# EAGLE design guava1_1 (EAGLE 8.0.0)
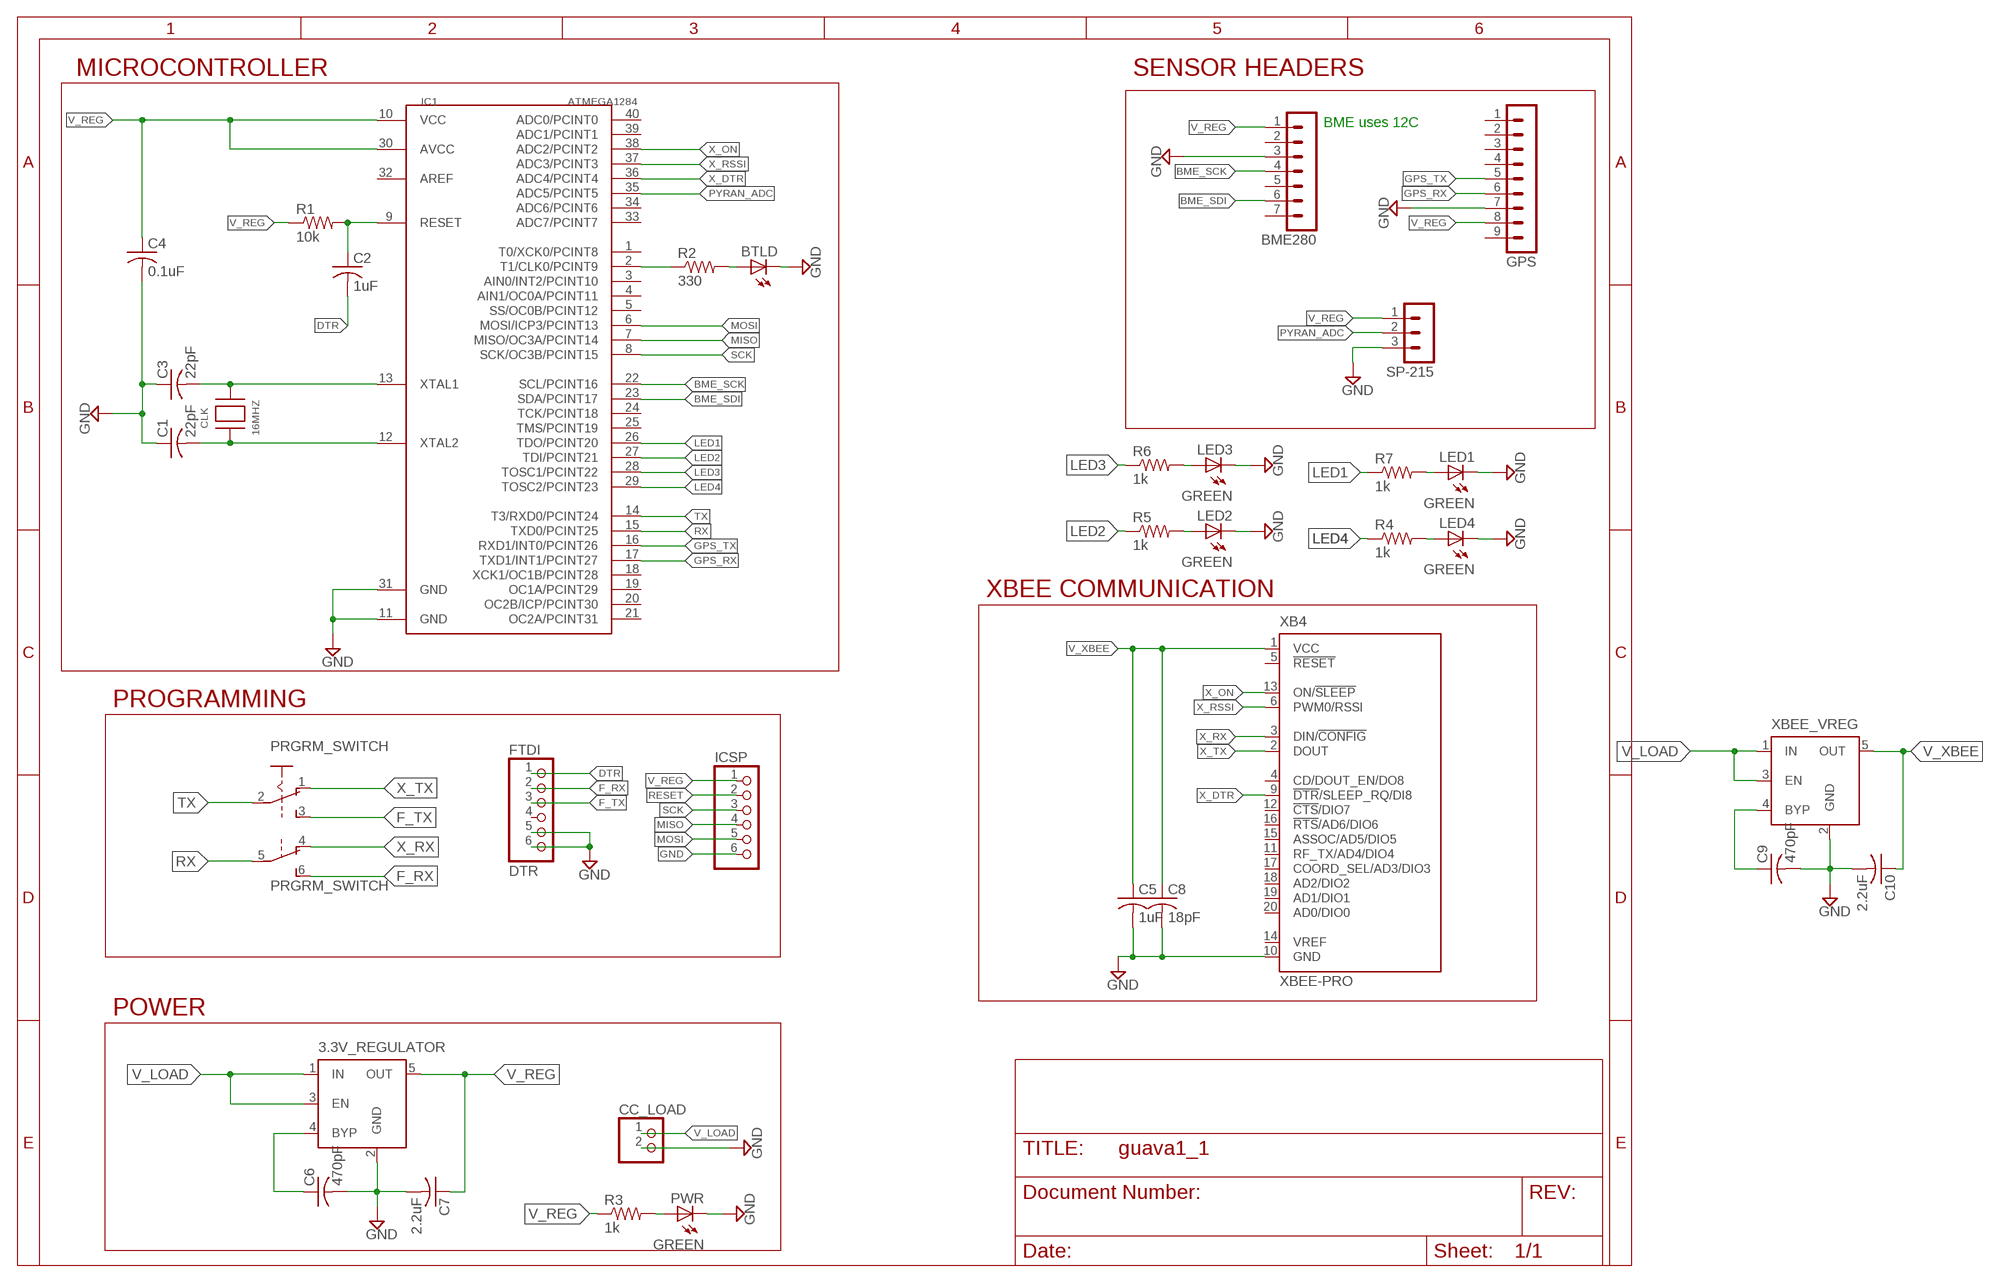
[diagram p0: schematic, sheet 1]

## Parts
3.3V_REGULATOR  MIC5219XX  [SOT23-5]
BME280  MA07-1  [MA07-1]
BTLD  LEDCHIPLED_0805  [CHIPLED_0805]
C1  22pF  C-USC0805  [C0805]
C2  1uF  C-USC0805  [C0805]
C3  22pF  C-USC0805  [C0805]
C4  0.1uF  C-USC0805  [C0805]
C5  1uF  C-USC0805  [C0805]
C6  470pF  C-USC0805  [C0805]
C7  2.2uF  C-USC0805  [C0805]
C8  18pF  C-USC0805  [C0805]
C9  470pF  C-USC0805  [C0805]
C10  2.2uF  C-USC0805  [C0805]
CC_LOAD  PINHD-1X2  [1X02]
CLK  16MHZ  XTALNX8045  [NX8045]
FTDI  DTR  PINHD-1X6  [1X06]
GPS  MA09-1  [MA09-1]
IC1  ATMEGA1284  MEGA1284P  [DIL40]
ICSP  PINHD-1X6  [1X06]
LED1  GREEN  LEDCHIPLED_0805  [CHIPLED_0805]
LED2  GREEN  LEDCHIPLED_0805  [CHIPLED_0805]
LED3  GREEN  LEDCHIPLED_0805  [CHIPLED_0805]
LED4  GREEN  LEDCHIPLED_0805  [CHIPLED_0805]
PRGRM_SWITCH  A68-A31  [A68-A31]
PWR  GREEN  LEDCHIPLED_0805  [CHIPLED_0805]
R1  10k  R-US_R0805  [R0805]
R2  330  R-US_R0805  [R0805]
R3  1k  R-US_R0805  [R0805]
R4  1k  R-US_R0805  [R0805]
R5  1k  R-US_R0805  [R0805]
R6  1k  R-US_R0805  [R0805]
R7  1k  R-US_R0805  [R0805]
SP-215  MA03-1  [MA03-1]
XB4  XBEE-PRO  [XBEE-PRO]
XBEE_VREG  MIC5219XX  [SOT23-5]

## Nets
BME_SCK: BME280.4 IC1.22(SCL/PCINT16)
BME_SDI: BME280.6 IC1.23(SDA/PCINT17)
DTR: C2.2 FTDI.1
F_RX: FTDI.2 PRGRM_SWITCH.6(B:S)
F_TX: FTDI.3 PRGRM_SWITCH.3(A:S)
GND: 3.3V_REGULATOR.2(GND) BME280.3 BTLD.C C1.1 C3.1 C4.2 C5.2 C6.2 C7.2 C8.2 C9.2 C10.2 CC_LOAD.2 FTDI.5 FTDI.6 GPS.7 IC1.11(GND) IC1.31(GND) ICSP.6 LED1.C LED2.C LED3.C LED4.C PWR.C SP-215.3 XB4.10(GND) XBEE_VREG.2(GND)
GPS_RX: GPS.6 IC1.17(TXD1/INT1/PCINT27)
GPS_TX: GPS.5 IC1.16(RXD1/INT0/PCINT26)
LED1: IC1.26(TDO/PCINT20) R7.1
LED2: IC1.27(TDI/PCINT21) R5.1
LED3: IC1.28(TOSC1/PCINT22) R6.1
LED4: IC1.29(TOSC2/PCINT23) R4.1
MISO: IC1.7(MISO/OC3A/PCINT14) ICSP.4
MOSI: IC1.6(MOSI/ICP3/PCINT13) ICSP.5
N$1: C3.2 CLK.P$2 IC1.13(XTAL1)
N$2: C1.2 CLK.P$1 IC1.12(XTAL2)
N$3: C2.1 IC1.9(RESET) R1.2
N$4: IC1.2(T1/CLK0/PCINT9) R2.1
N$5: BTLD.A R2.2
N$6: 3.3V_REGULATOR.4(BYP) C6.1
N$7: PWR.A R3.2
N$8: LED4.A R4.2
N$9: LED2.A R5.2
N$10: LED3.A R6.2
N$11: LED1.A R7.2
N$14: C9.1 XBEE_VREG.4(BYP)
PYRAN_ADC: IC1.35(ADC5/PCINT5) SP-215.2
RESET: ICSP.2
RX: IC1.15(TXD0/PCINT25) PRGRM_SWITCH.5(B:P)
SCK: IC1.8(SCK/OC3B/PCINT15) ICSP.3
TX: IC1.14(T3/RXD0/PCINT24) PRGRM_SWITCH.2(A:P)
V_LOAD: 3.3V_REGULATOR.1(IN) 3.3V_REGULATOR.3(EN) CC_LOAD.1 XBEE_VREG.1(IN) XBEE_VREG.3(EN)
V_REG: 3.3V_REGULATOR.5(OUT) BME280.1 C4.1 C7.1 GPS.8 IC1.10(VCC) IC1.30(AVCC) ICSP.1 R1.1 R3.1 SP-215.1
V_XBEE: C5.1 C8.1 C10.1 XB4.1(VCC) XBEE_VREG.5(OUT)
X_DTR: IC1.36(ADC4/PCINT4) XB4.9(!DTR!/SLEEP_RQ/DI8)
X_ON: IC1.38(ADC2/PCINT2) XB4.13(ON/!SLEEP)
X_RSSI: IC1.37(ADC3/PCINT3) XB4.6(PWM0/RSSI)
X_RX: PRGRM_SWITCH.4(B:O) XB4.3(DIN/!CONFIG)
X_TX: PRGRM_SWITCH.1(A:O) XB4.2(DOUT)
Unconnected: BME280.2 BME280.5 BME280.7 FTDI.4 GPS.1 GPS.2 GPS.3 GPS.4 GPS.9 IC1.1(T0/XCK0/PCINT8) IC1.3(AIN0/INT2/PCINT10) IC1.4(AIN1/OC0A/PCINT11) IC1.5(SS/OC0B/PCINT12) IC1.18(XCK1/OC1B/PCINT28) IC1.19(OC1A/PCINT29) IC1.20(OC2B/ICP/PCINT30) IC1.21(OC2A/PCINT31) IC1.24(TCK/PCINT18) IC1.25(TMS/PCINT19) IC1.32(AREF) IC1.33(ADC7/PCINT7) IC1.34(ADC6/PCINT6) IC1.39(ADC1/PCINT1) IC1.40(ADC0/PCINT0) XB4.4(CD/DOUT_EN/DO8) XB4.5(!RESET) XB4.11(RF_TX/AD4/DIO4) XB4.12(!CTS!/DIO7) XB4.14(VREF) XB4.15(ASSOC/AD5/DIO5) XB4.16(!RTS!/AD6/DIO6) XB4.17(COORD_SEL/AD3/DIO3) XB4.18(AD2/DIO2) XB4.19(AD1/DIO1) XB4.20(AD0/DIO0)

## Notes on the sheet
- MICROCONTROLLER | SENSOR HEADERS
- BME uses 12C
- XBEE COMMUNICATION
- PROGRAMMING
- POWER

## Library data of the parts
3.3V_REGULATOR XBEE_VREG = v-reg-micrel:MIC5219XX: VOLTAGE REGULATOR; OC_FARNELL: unknown; OC_NEWARK: unknown
BME280 = con-lstb:MA07-1: PIN HEADER; OC_FARNELL: unknown; OC_NEWARK: unknown
BTLD LED1-LED4 PWR = adafruit:LED: LED OSRAM: - CHIPLED LG R971, LG N971, LY N971, LG Q971, LY Q971, LO R971, LY R971 LH N974, LH R974 LS Q976, LO Q976, LY Q976 LO Q996 - Hyper CHIPLED LW Q18S LB Q993, LB Q99A, LB R99A - SideLED LS A670, LO A670, LY A670, LG A670, LP A670 LB A673, LV A673, LT A673, LW A673 LH A674 LY A675 LS A676, LA A676, LO A676, LY A676, LW A676 LS A679, LY A679, LG A679 - Hyper Micro SIDELED® LS Y876, LA Y876, LO Y876, LY Y876 LT Y87S - SmartLED LW L88C, LW L88S LB L89C, LB L89S, LG L890 LS L89K, LO L89K, LY L89K LS L896, LA L896, LO L896, LY L896 - TOPLED LS T670, LO T670, LY T670, LG T670, LP T670 LSG T670, LSP T670, LSY T670, LOP T670, LYG T670 LG T671, LOG T671, LSG T671 LB T673, LV T673, LT T673, LW T673 LH T674 LS T676, LA T676, LO T676, LY T676, LB T676, LH T676, LSB T676, LW T676 LB T67C, LV T67C, LT T67C, LS T67K, LO T67K, LY T67K, LW E67C LS E67B, LA E67B, LO E67B, LY E67B, LB E67C, LV E67C, LT E67C LW T67C LS T679, LY T679, LG T679 LS T770, LO T770, LY T770, LG T770, LP T770 LB T773, LV T773, LT T773, LW T773 LH T774 LS E675, LA E675, LY E675, LS T675 LS T776, LA T776, LO T776, LY T776, LB T776 LHGB T686 LT T68C, LB T68C - Hyper Mini TOPLED® LB M676 - Mini TOPLED Santana® LG M470 LS M47K, LO M47K, LY M47K Source: http://www.osram.convergy.de/
C1-C10 = adafruit:C-US: CAPACITOR, American symbol
CC_LOAD = pinhead:PINHD-1X2: PIN HEADER
CLK = adafruit:XTAL: Low cost SMT crystals, no capacitors included http://www.ladyada.net/library/eagle
FTDI = adafruit:PINHD-1X6: PIN HEADER
GPS = con-lstb:MA09-1: PIN HEADER; OC_FARNELL: unknown; OC_NEWARK: unknown
IC1 = 1284p:MEGA1284P: Atmel ATmega1284P 8-bit AVR Microcontroller
ICSP = pinhead:PINHD-1X6: PIN HEADER
PRGRM_SWITCH = switch:A68-A31: SLIDING SWITCH Siemens, distributor Buerklin, 11G766
R1-R7 = adafruit:R-US_: RESISTOR, American symbol
SP-215 = con-lstb:MA03-1: PIN HEADER; OC_FARNELL: unknown; OC_NEWARK: unknown
XB4 = maxstream:XBEE: XBee (TM) /XBee-PRO(TM) OEM RF Modules Source: MaxStream, Inc. xbee_productmanual.pdf; MPN: XBP24-AWI-001; OC_FARNELL: 1337916; OC_NEWARK: 42M2667

## Board
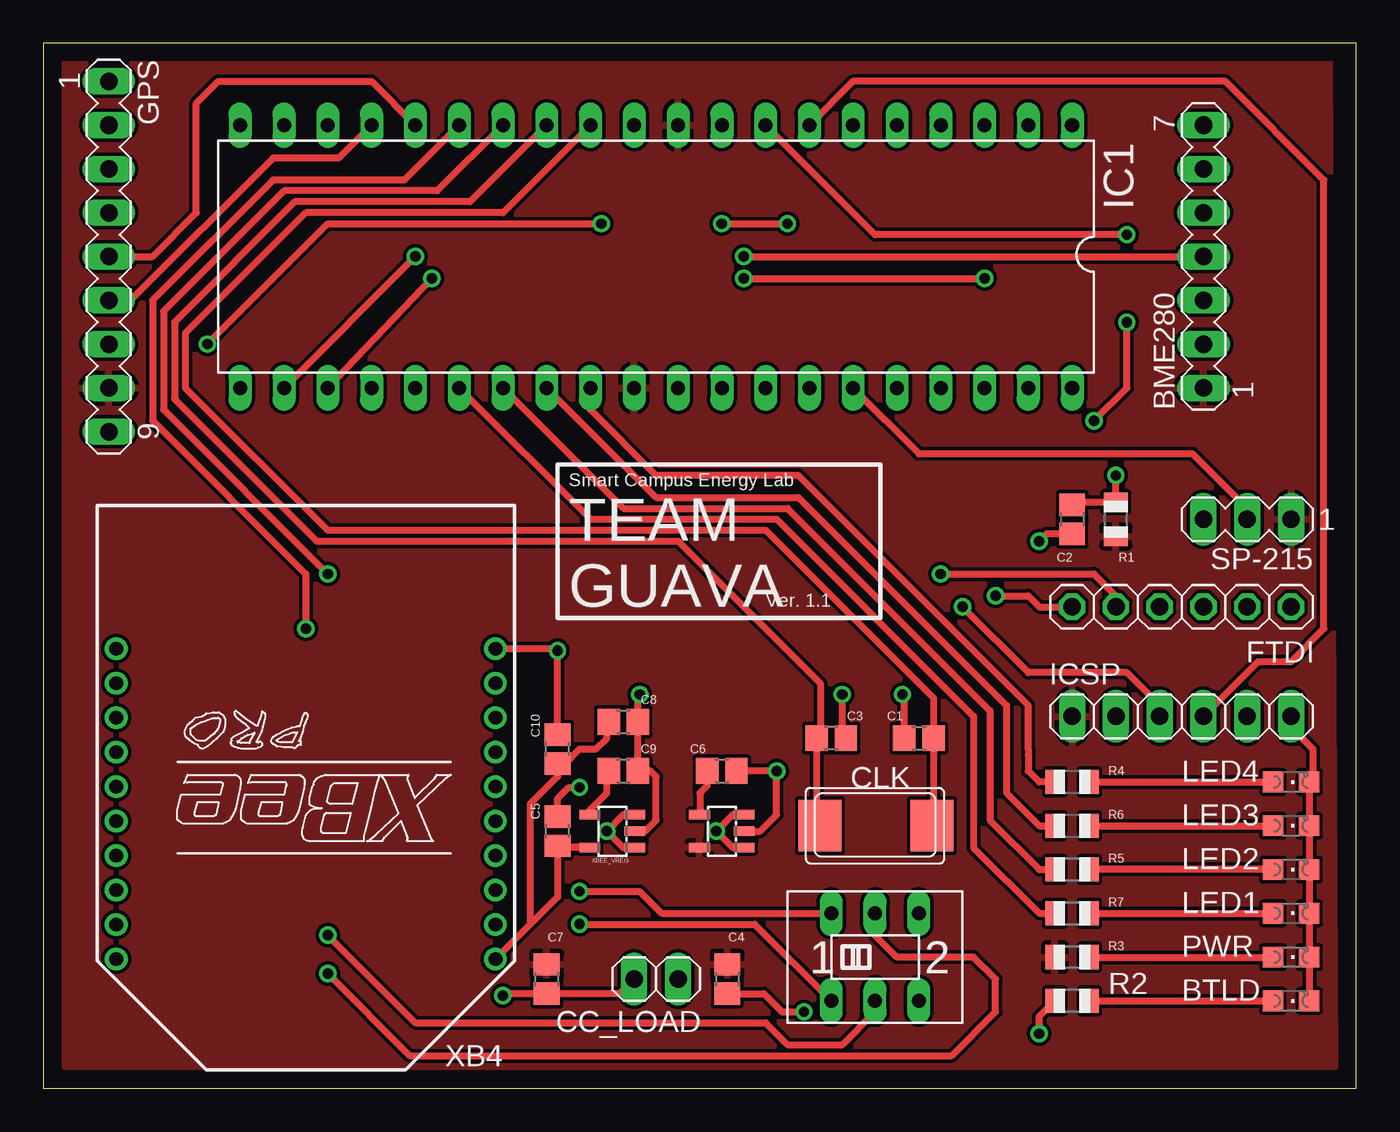
[diagram p1: board, top side]
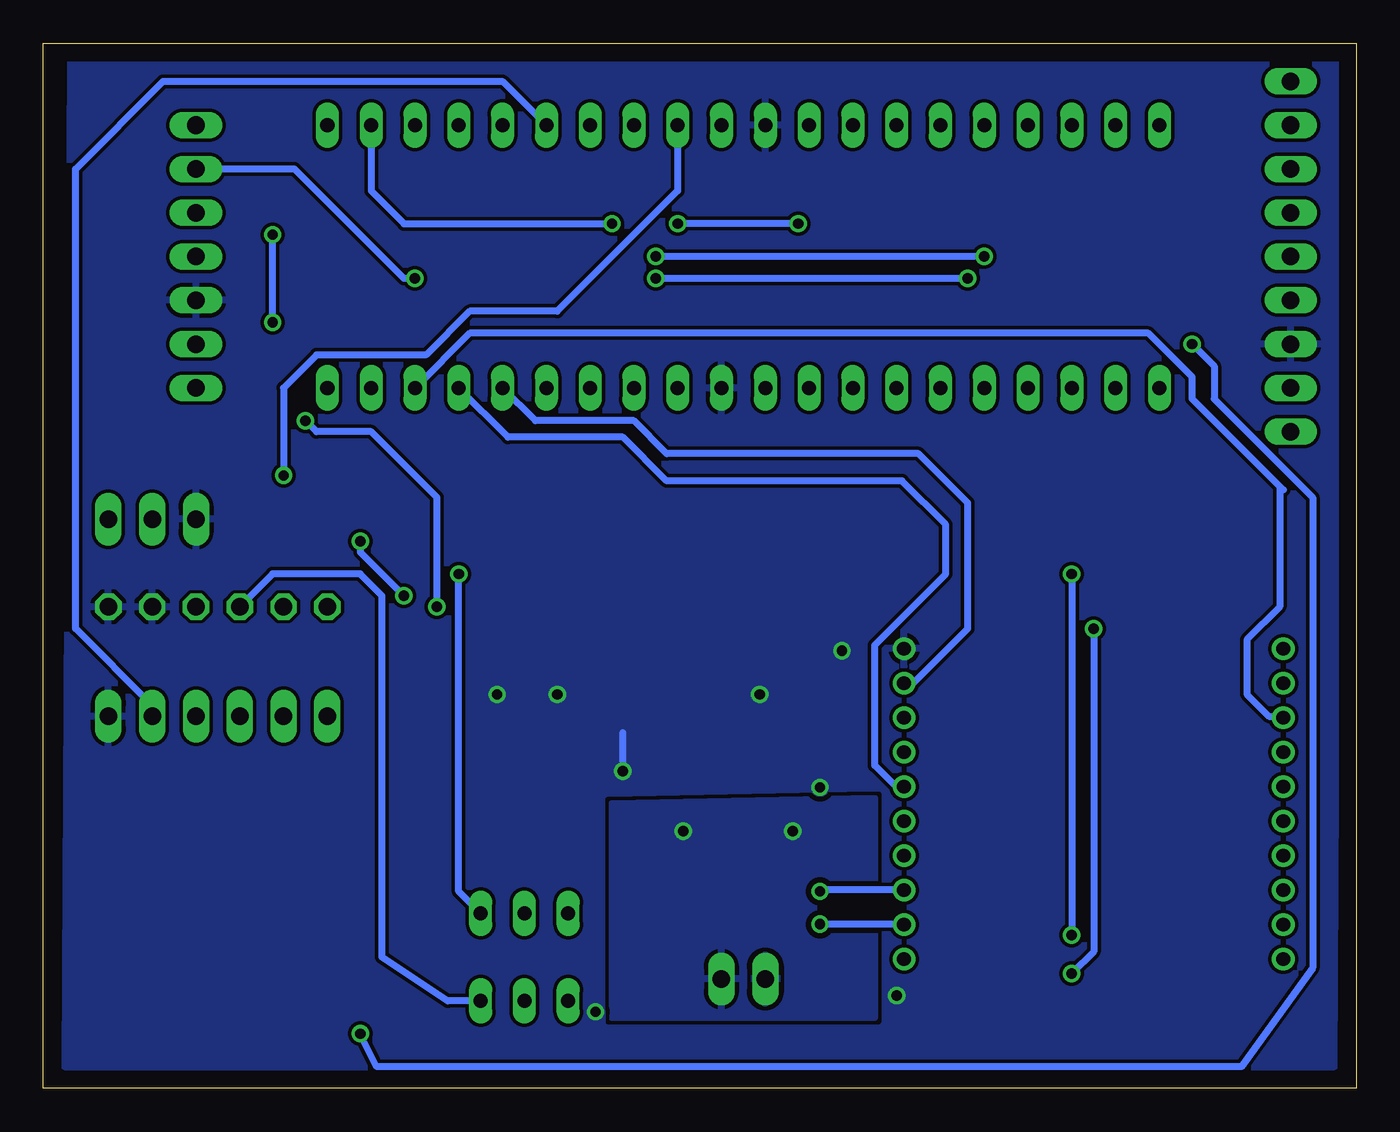
[diagram p2: board, bottom side, seen from below]

Size 76.18 x 60.64 mm. Coordinates in mm from the lower left corner, seen from the top.
Outline: 0,0 76.18,0 76.18,60.63 0.01,60.64 0,0
Copper layers (1*16): Top 0.035mm / dielectric 1.5mm / Bottom 0.035mm
Design rules "default *": minimum track width 10mil, minimum drill 10mil, track to track 8mil, track to pad 8mil, pad to pad 8mil, via to via 8mil, smd to smd 8mil, copper to edge 40mil, drill to drill 8mil, minimum pad ring 10mil, minimum via ring 8mil, stop-mask expansion 4mil, vias tented up to drill 0mil, thermal gap 10mil

### Footprints (pad centres in the part's own frame; a part is rotated, then mirrored left to right if it is on the bottom)
SOT23-5 = smd 0.55 x 1.2: 1 -0.95,-1.3; 2 0,-1.3; 3 0.95,-1.3; 4 0.95,1.3; 5 -0.95,1.3
MA07-1 = drill 1.016 long: 1 -7.62,0; 2 -5.08,0; 3 -2.54,0; 4 0,0; 5 2.54,0; 6 5.08,0; 7 7.62,0
CHIPLED_0805 = smd 1.2 x 1.2: A 0,-1.05; C 0,1.05
C0805 = smd 1.3 x 1.5: 1 -0.85,0; 2 0.85,0
1X02 = drill 1.016 long: 1 -1.27,0; 2 1.27,0
NX8045 = smd 2.5 x 3: P$1 3.3,0; P$2 -3.2,0
1X06 = drill 1.016 octagon: 1 -6.35,0; 2 -3.81,0; 3 -1.27,0; 4 1.27,0; 5 3.81,0; 6 6.35,0
MA09-1 = drill 1.016 long: 1 -10.16,0; 2 -7.62,0; 3 -5.08,0; 4 -2.54,0; 5 0,0; 6 2.54,0; 7 5.08,0; 8 7.62,0; 9 10.16,0
DIL40 = drill 0.813 long: 1 -24.13,-7.62; 2 -21.59,-7.62; 3 -19.05,-7.62; 4 -16.51,-7.62; 5 -13.97,-7.62; 6 -11.43,-7.62; 7 -8.89,-7.62; 8 -6.35,-7.62; 9 -3.81,-7.62; 10 -1.27,-7.62; 11 1.27,-7.62; 12 3.81,-7.62; 13 6.35,-7.62; 14 8.89,-7.62; 15 11.43,-7.62; 16 13.97,-7.62; 17 16.51,-7.62; 18 19.05,-7.62; 19 21.59,-7.62; 20 24.13,-7.62; 21 24.13,7.62; 22 21.59,7.62; 23 19.05,7.62; 24 16.51,7.62; 25 13.97,7.62; 26 11.43,7.62; 27 8.89,7.62; 28 6.35,7.62; 29 3.81,7.62; 30 1.27,7.62; 31 -1.27,7.62; 32 -3.81,7.62; 33 -6.35,7.62; 34 -8.89,7.62; 35 -11.43,7.62; 36 -13.97,7.62; 37 -16.51,7.62; 38 -19.05,7.62; 39 -21.59,7.62; 40 -24.13,7.62
1X06' = drill 1.016 long: 1 -6.35,0; 2 -3.81,0; 3 -1.27,0; 4 1.27,0; 5 3.81,0; 6 6.35,0
A68-A31 = drill 0.813 long: 1 -2.54,-2.54; 2 0,-2.54; 3 2.54,-2.54; 4 -2.54,2.54; 5 0,2.54; 6 2.54,2.54
R0805 = smd 1.1 x 1.4: 1 -1,0; 2 1,0
MA03-1 = drill 1.016 long: 1 -2.54,0; 2 0,0; 3 2.54,0
XBEE-PRO = drill 0.8 pad 1.27: 1 -11,9; 2 -11,7; 3 -11,5; 4 -11,3; 5 -11,1; 6 -11,-1; 7 -11,-3; 8 -11,-5; 9 -11,-7; 10 -11,-9; 11 11,-9; 12 11,-7; 13 11,-5; 14 11,-3; 15 11,-1; 16 11,1; 17 11,3; 18 11,5; 19 11,7; 20 11,9

### Placement (x,y rotation side)
3.3V_REGULATOR  39.37,14.92 90 top
BME280  67.31,48.26 90 top
BTLD  72.39,5.08 270 top
C1  50.8,20.32 0 top
C2  59.69,33.02 270 top
C3  45.72,20.32 180 top
C4  39.69,6.35 270 top
C5  29.84,14.92 90 top
C6  39.37,18.41 0 top
C7  29.21,6.35 270 top
C8  33.66,21.27 0 top
C9  33.66,18.41 0 top
C10  29.84,19.68 90 top
CC_LOAD  35.56,6.35 180 top
CLK  48.26,15.24 0 top
FTDI  66.04,27.94 0 top
GPS  3.81,48.26 270 top
IC1  35.56,48.26 180 top
ICSP  [1X06']  66.04,21.59 0 top
LED1  72.39,10.16 270 top
LED2  72.39,12.7 270 top
LED3  72.39,15.24 270 top
LED4  72.39,17.78 270 top
PRGRM_SWITCH  48.26,7.62 0 top
PWR  72.39,7.62 270 top
R1  62.23,33.02 90 top
R2  59.69,5.08 0 top
R3  59.69,7.62 0 top
R4  59.69,17.78 0 top
R5  59.69,12.7 0 top
R6  59.69,15.24 0 top
R7  59.69,10.16 0 top
SP-215  69.85,33.02 180 top
XB4  15.24,16.51 180 top
XBEE_VREG  33.02,14.92 90 top

### Tracks (layer width: path | path; a pad name or v marks a point on that pad's centre or on a via)
BME_SCK  (via drill 0.6)
  Top 0.406: v40.64,48.26 BME280.4 | IC1.22 v21.59,48.26
  Bottom 0.406: v21.59,48.26 v40.64,48.26
BME_SDI  (via drill 0.6)
  Top 0.406: v40.64,46.99 v54.61,46.99 | IC1.23 v22.54,46.99
  Bottom 0.406: v54.61,46.99 55.24,46.99 61.59,53.34 BME280.6 | v22.54,46.99 v40.64,46.99
DTR  (via drill 0.6)
  Top 0.406: C2.2 58.2,32.17 v57.78,31.75 | v55.24,28.57 57.15,28.57 57.78,27.94 FTDI.1
  Bottom 0.406: v57.78,31.75 57.78,31.11 v55.24,28.57
F_RX  (via drill 0.6)
  Top 0.406: FTDI.2 62.23,28.57 60.96,29.84 v52.07,29.84
  Bottom 0.406: PRGRM_SWITCH.6 52.07,11.43 v52.07,29.84
F_TX
  Bottom 0.406: PRGRM_SWITCH.3 52.7,5.08 56.52,7.62 56.52,28.57 57.78,29.84 62.87,29.84 FTDI.3
GND  (via drill 0.6)
  Top 0.406: CC_LOAD.2 33.44,5.5 C7.2 26.77,5.5 v26.67,5.4 | C3.1 46.35,20.54 v46.35,22.86 | ICSP.6 72.39,20.95 73.66,19.68 73.66,18 LED4.C LED3.C LED2.C LED1.C PWR.C BTLD.C | C4.2 41.81,5.5 42.86,4.45 v44.13,4.45 | C6.2 v42.55,18.41 42.55,15.88 41.59,14.92 3.3V_REGULATOR.2 | C1.1 49.95,22.76 v49.85,22.86 | XBEE_VREG.2 34.92,14.92 35.56,15.56 35.56,18.1 35.24,18.41 C9.2 C8.2 34.51,22.76 v34.61,22.86 | XB4.10 29.73,25.51 v29.84,25.4 C10.2 | v31.11,17.46 30.48,17.46 29.84,16.83 C5.2
  Bottom 0.406: v42.55,18.41 42.55,20.64
  pour Bottom (rank 2): 0.95,59.69 74.61,59.69 74.93,1.27 1.27,1.27
GPS_RX
  Top 0.406: IC1.17 17.14,53.98 13.34,53.98 5.08,45.72 GPS.6
GPS_TX
  Top 0.406: GPS.5 6.35,48.26 8.89,50.8 8.89,57.15 10.16,58.42 19.05,58.42 IC1.16
LED1
  Top 0.406: IC1.26 31.75,33.02 42.55,33.02 53.98,21.59 53.98,13.97 57.78,10.16 R7.1 58.42,10.16
LED2
  Top 0.406: IC1.27 33.66,33.66 43.18,33.66 54.93,21.91 54.93,15.56 57.78,12.7 R5.1 58.42,12.7
LED3
  Top 0.406: IC1.28 35.56,34.29 43.81,34.29 55.88,22.23 55.88,17.14 57.78,15.24 R6.1
LED4
  Top 0.406: 57.15,19.68 57.15,19.32 | 57.15,19.68 57.15,22.23 43.81,35.56 35.56,35.56 31.75,39.37 IC1.29 | 57.15,19.68 57.15,19.32 | 57.15,19.32 57.15,18.41 57.78,17.78 58.42,17.78 | 58.42,17.78 R4.1 58.42,17.78
MISO
  Top 0.406: ICSP.4 70.48,24.77 72.39,24.77 74.3,26.67 74.3,52.7 68.58,58.42 46.99,58.42 IC1.7
MOSI
  Bottom 0.406: ICSP.5 69.85,22.23 74.3,26.67 74.3,53.34 69.22,58.42 49.53,58.42 IC1.6
N$1
  Top 0.406: CLK.P$2 44.87,15.43 C3.2 44.87,20.74 45.09,20.95 45.09,23.5 36.83,31.75 15.88,31.75 7.62,40.01 7.62,44.45 14.61,51.44 24.77,51.44 IC1.13
N$2
  Top 0.406: CLK.P$1 51.65,15.33 C1.2 51.65,22.64 41.91,32.38 16.51,32.38 8.26,40.64 8.26,43.81 15.24,50.8 26.67,50.8 IC1.12
N$3  (via drill 0.6)
  Top 0.406: C2.1 59.84,34.02 R1.2 v62.23,35.56
  Bottom 0.406: v62.23,35.56 62.23,40.64 60.33,42.55 53.98,42.55 51.44,45.09 46.35,45.09 39.37,52.07 IC1.9
N$4  (via drill 0.6)
  Top 0.406: v9.53,43.18 16.51,50.16 v32.38,50.16 | v57.78,3.17 57.78,4.17 R2.1 | v39.37,50.16 v43.18,50.16
  Bottom 0.406: IC1.2 57.15,52.07 55.24,50.16 v43.18,50.16 | v9.53,43.18 8.26,41.91 8.26,40.01 2.54,34.29 2.54,6.99 6.67,1.27 56.83,1.27 v57.78,3.17 | v32.38,50.16 v39.37,50.16
N$5
  Top 0.406: R2.2 BTLD.A
N$6
  Top 0.406: C6.1 38.52,17.57 38.1,17.14 38.1,15.9 3.3V_REGULATOR.4
N$7
  Top 0.406: R3.2 PWR.A
N$8
  Top 0.406: R4.2 LED4.A
N$9
  Top 0.406: LED2.A R5.2
N$10
  Top 0.406: R6.2 LED3.A
N$11
  Top 0.406: R7.2 LED1.A
N$14
  Top 0.406: XBEE_VREG.4 31.72,16.16 32.7,17.14 32.7,18.31 C9.1
PYRAN_ADC
  Top 0.406: IC1.35 50.8,36.83 66.67,36.83 69.85,33.66 SP-215.2
RX  (via drill 0.6)
  Top 0.406: IC1.15 20.95,52.7 13.34,52.7 6.35,45.72 6.35,38.73 15.24,29.84 v15.24,26.67 | PRGRM_SWITCH.5 48.26,8.89 49.53,7.62 53.98,7.62 55.24,6.35 55.24,4.45 52.7,1.91 21.27,1.91 v16.51,6.67
  Bottom 0.406: v16.51,6.67 15.24,7.94 v15.24,26.67
SCK  (via drill 0.6)
  Top 0.406: ICSP.3 64.77,22.23 62.87,24.13 57.15,24.13 v53.34,27.94 | v60.96,38.73 62.87,40.64 v62.87,44.45 | v62.87,49.53 48.26,49.53 IC1.8
  Bottom 0.406: v60.96,38.73 60.33,38.1 57.15,38.1 53.34,34.29 v53.34,27.94 | v62.87,44.45 v62.87,49.53
TX  (via drill 0.6)
  Top 0.406: IC1.14 22.86,52.07 13.97,52.07 6.99,45.09 6.99,39.37 v16.51,29.84 | v16.51,8.89 21.59,3.81 41.91,3.81 43.18,2.54 46.35,2.54 48.26,4.45 PRGRM_SWITCH.2
  Bottom 0.406: v16.51,29.84 v16.51,8.89
V_LOAD  (via drill 0.6)
  Top 0.406: XBEE_VREG.3 33.65,15.87 v32.7,14.92 33.65,13.97 XBEE_VREG.1 | 3.3V_REGULATOR.1 40,13.97 v39.05,14.92 40,15.87 3.3V_REGULATOR.3
  pour Bottom (isolate 0.305): 27.94,16.83 43.18,16.51 43.18,4.13 27.94,4.13
V_REG
  Top 0.406: GPS.8 2.54,40.64
  pour Top: 0.95,59.69 74.61,59.69 74.93,1.27 1.27,1.27
V_XBEE
  Top 0.406: XB4.1 28.26,9.53 | 28.26,9.53 29.84,11.11 C5.1 29.95,13.97 XBEE_VREG.5 | C10.1 29.84,18.1 28.26,16.51 28.26,9.53 | 29.95,18.73 C10.1 | C10.1 30.27,18.84 31.11,19.68 32.07,19.68 32.7,20.32 32.7,21.17 C8.1
X_DTR
  Bottom 0.406: XB4.9 25.7,23.51 22.54,26.67 22.54,31.75 | 22.54,31.75 22.54,32.07 | IC1.36 47.62,38.73 41.91,38.73 40.01,36.83 25.4,36.83 22.54,33.97 22.54,31.75
X_ON
  Bottom 0.406: IC1.38 51.44,43.81 12.06,43.81 9.53,41.27 9.53,40.01 4.45,34.92 | 4.24,34.72 4.45,34.92 | 4.45,34.92 4.45,27.94 6.35,26.04 6.35,22.86 5.08,21.59 4.32,21.59 XB4.13
X_RSSI
  Bottom 0.406: XB4.6 26.72,17.51 27.94,18.73 27.94,25.72 23.81,29.84 23.81,32.7 26.35,35.24 40.01,35.24 42.55,37.78 49.21,37.78 IC1.37
X_RX  (via drill 0.6)
  Top 0.406: v31.11,11.43 34.61,11.43 35.88,10.16 PRGRM_SWITCH.4
  Bottom 0.406: XB4.3 31.04,11.51 v31.11,11.43
X_TX  (via drill 0.6)
  Top 0.406: v31.11,9.53 41.27,9.53 PRGRM_SWITCH.1
  Bottom 0.406: XB4.2 31.1,9.51 v31.11,9.53

### Text on the board
tPlace: Smart Campus Energy Lab | TEAM / GUAVA | Ver. 1.1
200bmp: C:/Users/xshan/OneDrive/Pictures/guava copy.bmp